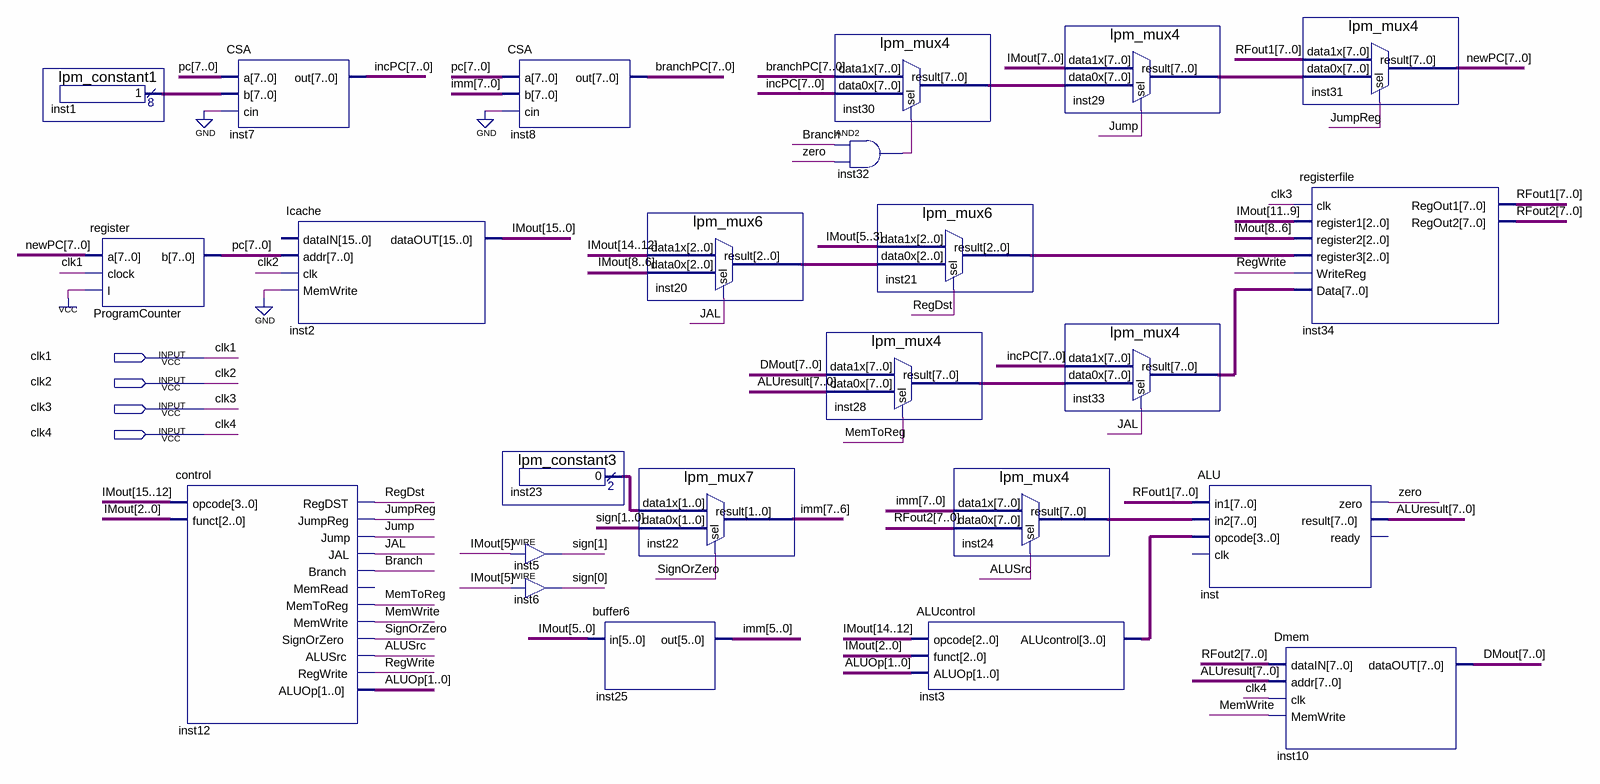
[diagram p0: schematic sheet]
// Quartus schematic SingleCycle.bdf as structural Verilog: 24 symbols, 4 pins
module SingleCycle (
  input  clk1,
  input  clk2,
  input  clk3,
  input  clk4
);

  wire ALUSrc, Branch, inst32_out, JAL, Jump, JumpReg, MemToReg, MemWrite, RegDst, RegWrite, SignOrZero, zero;
  wire [1:0] ALUOp, inst23_result, sign;
  wire [2:0] inst20_result, inst21_result;
  wire [3:0] inst3_alucontrol;
  wire [7:0] ALUresult, branchPC, DMout, imm, incPC, inst1_result, inst24_result, inst28_result,
       inst29_result, inst30_result, inst33_result, newPC, pc, RFout1, RFout2;
  wire [15:0] IMout;

  lpm_constant1 inst1 (.result(inst1_result));
  register ProgramCounter (.a(newPC), .clock(clk1), .l(1'b1), .b(pc));
  control inst12 (
    .opcode(IMout[15:12]), .funct(IMout[2:0]), .RegDST(RegDst), .JumpReg(JumpReg), .Jump(Jump), .JAL(JAL),
    .Branch(Branch), .MemToReg(MemToReg), .MemWrite(MemWrite), .SignOrZero(SignOrZero), .ALUSrc(ALUSrc),
    .RegWrite(RegWrite), .ALUOp(ALUOp));  // open: MemRead
  CSA inst7 (.a(pc), .b(inst1_result), .cin(1'b0), .out(incPC));
  Icache inst2 (.addr(pc), .clk(clk2), .MemWrite(1'b0), .dataOUT(IMout));  // open: dataIN
  CSA inst8 (.a(pc), .b(imm), .cin(1'b0), .out(branchPC));
  lpm_constant3 inst23 (.result(inst23_result));
  assign sign[1] = IMout[5];  // WIRE inst5
  assign sign[0] = IMout[5];  // WIRE inst6
  buffer6 inst25 (.in(IMout[5:0]), .out(imm[5:0]));
  lpm_mux6 inst20 (.data1x(IMout[14:12]), .data0x(IMout[8:6]), .sel(JAL), .result(inst20_result));
  lpm_mux7 inst22 (.data1x(inst23_result), .data0x(sign), .sel(SignOrZero), .result(imm[7:6]));
  lpm_mux4 inst30 (.data1x(branchPC), .data0x(incPC), .sel(inst32_out), .result(inst30_result));
  and inst32 (inst32_out, Branch, zero);
  lpm_mux4 inst28 (.data1x(DMout), .data0x(ALUresult), .sel(MemToReg), .result(inst28_result));
  lpm_mux6 inst21 (.data1x(IMout[5:3]), .data0x(inst20_result), .sel(RegDst), .result(inst21_result));
  ALUcontrol inst3 (.opcode(IMout[14:12]), .funct(IMout[2:0]), .ALUOp(ALUOp), .ALUcontrol(inst3_alucontrol));
  lpm_mux4 inst24 (.data1x(imm), .data0x(RFout2), .sel(ALUSrc), .result(inst24_result));
  lpm_mux4 inst29 (.data1x(IMout[7:0]), .data0x(inst30_result), .sel(Jump), .result(inst29_result));
  lpm_mux4 inst33 (.data1x(incPC), .data0x(inst28_result), .sel(JAL), .result(inst33_result));
  ALU inst (
    .in1(RFout1), .in2(inst24_result), .opcode(inst3_alucontrol), .zero(zero), .result(ALUresult));  // open: clk, ready
  Dmem inst10 (.dataIN(RFout2), .addr(ALUresult), .clk(clk4), .MemWrite(MemWrite), .dataOUT(DMout));
  lpm_mux4 inst31 (.data1x(RFout1), .data0x(inst29_result), .sel(JumpReg), .result(newPC));
  registerfile inst34 (
    .clk(clk3), .register1(IMout[11:9]), .register2(IMout[8:6]), .register3(inst21_result),
    .WriteReg(RegWrite), .Data(inst33_result), .RegOut1(RFout1), .RegOut2(RFout2));
endmodule
